# Altium schematic sheet Capteur_et_RTC.SchDoc
size A4; SheetNumber: 3; SheetTotal: 3
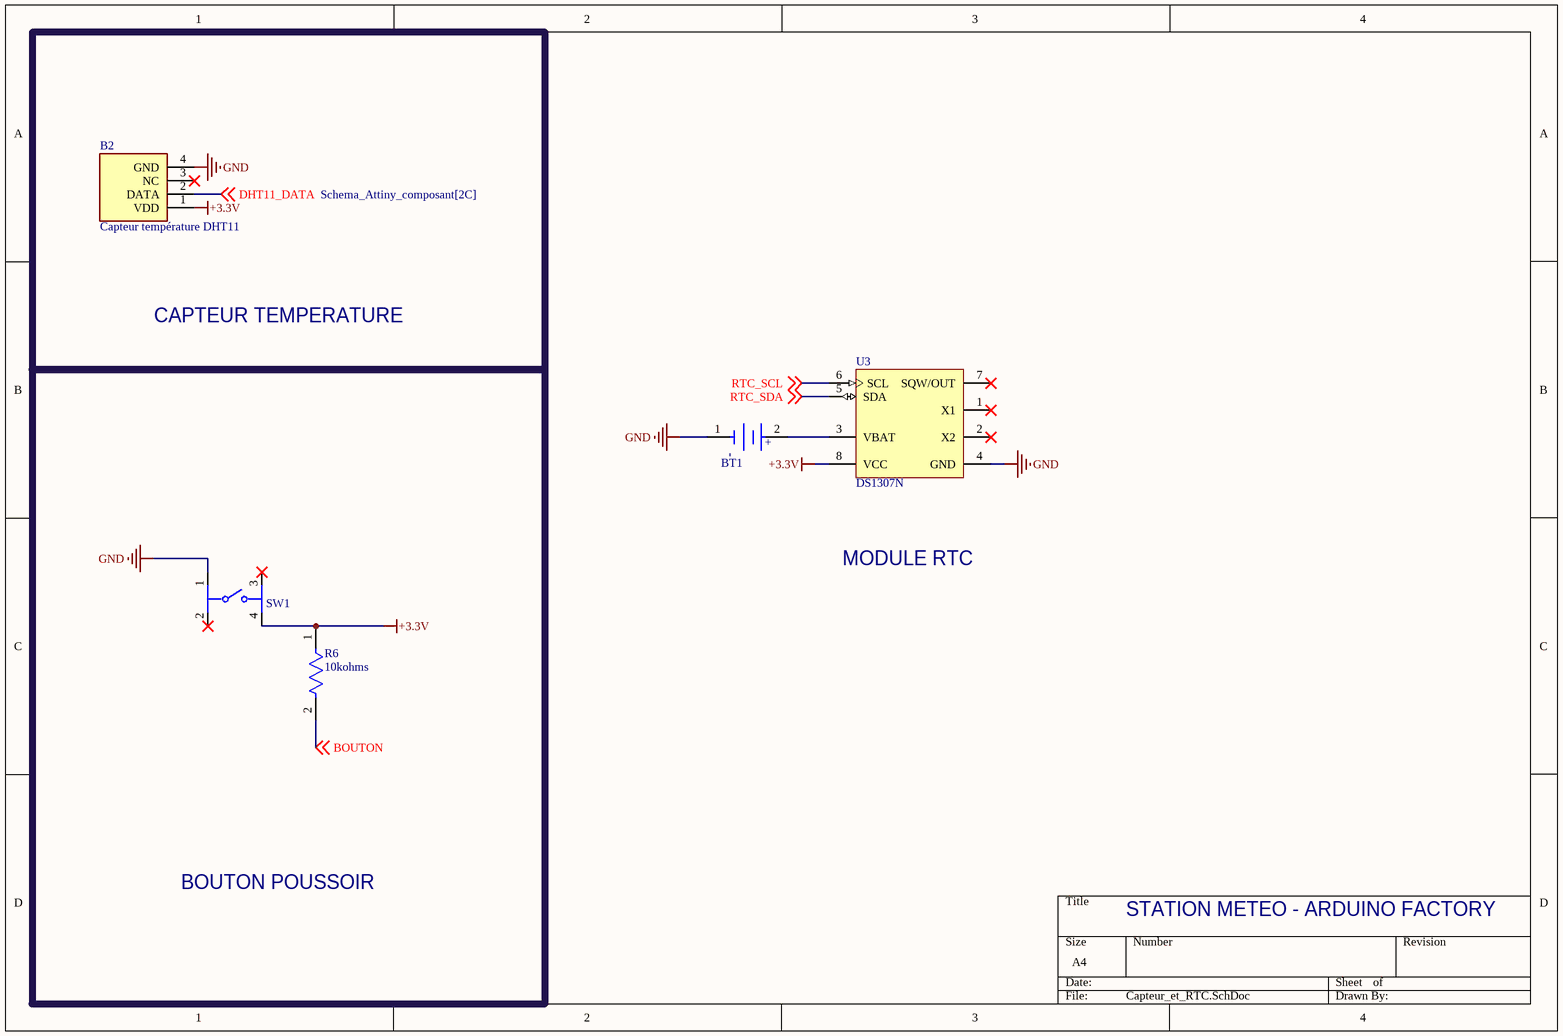
[diagram p0: Capteur_et_RTC.SchDoc]

## Parts
B2  Capteur température DHT11  [386]
BT1  3034TR  [Keystone_0_MFG]  (value not drawn)
R6  10kohms  [Stackpole_Electronics_Inc._CF14JT1K00_0]
SW1  1825910-2  [TE_0_0]  (value not drawn)
U3  DS1307N  [P8-2]

## Blocks framed on the sheet
CAPTEUR TEMPERATURE: B2
BOUTON POUSSOIR: R6 SW1

## Nets
+3.3V: B2.1(VDD) R6.1 SW1.4 U3.8(VCC)
GND: B2.4(GND) BT1.1(C) SW1.1 U3.4(GND)
BOUTON: R6.2 ; off-sheet BOUTON
DHT11_DATA: B2.2(DATA) ; off-sheet DHT11_DATA
RTC_SCL: U3.6(SCL) ; off-sheet RTC_SCL
RTC_SDA: U3.5(SDA) ; off-sheet RTC_SDA
NetBT1_2: BT1.2(A) U3.3(VBAT)

Not connected (* = marked no-connect by the designer): B2 3(NC)*; SW1 2* 3*; U3 1(X1)* 2(X2)* 7(SQW/OUT)*

## Notes on the sheet
- MODULE RTC
- STATION METEO - ARDUINO FACTORY
- (in symbol 3034TR) +; -

## Library data of the parts
B2 = 386: Adafruit Accessories DHT11 Basic Temp Humidity Sensor; Geometry.Height: 15.5mm; Manufacturer_Name: Adafruit; Manufacturer_Part_Number: 386; Mouser Part Number: 485-386; Mouser Price/Stock: https://www.mouser.co.uk/ProductDetail/Adafruit/386?qs=GURawfaeGuDbeGFpZ2393w%3D%3D; Arrow Part Number: 386; Arrow Price/Stock: https://www.arrow.com/en/products/386/adafruit-industries?region=nac; Datasheet Link: https://datasheet.datasheetarchive.com/originals/distributors/DKDS-1/1982.pdf
R6 = MF0207FTE52-10K
U3 = DS1307N: 64 x 8, Serial, I2C Real-Time Clock, 5.0V, 8-Pin PDIP, -40 to 85 degC; ComponentLink1Description: Manufacturer URL; ComponentLink2Description: Datasheet; DatasheetVersion: 10-Feb-2008; ComponentLink3URL: http://pdfserv.maxim-ic.com/package_dwgs/21-0043.PDF; ComponentLink3Description: Package Specification; ComponentLink1URL: http://www.maxim-ic.com; Code_JEDEC: MS-001-AB; PackageVersion: revE, 2011; PackageDescription: 8-Pin Plastic Dual-In-Line, Narrow (0.3in), Pitch 2.54 mm, PDIP(N); ComponentLink2URL: http://datasheets.maxim-ic.com/en/ds/DS1307.pdf; PackageReference: P8-2; PartNumber: DS1307N